# EAGLE design CAN_SPI (EAGLE 7.1.0)
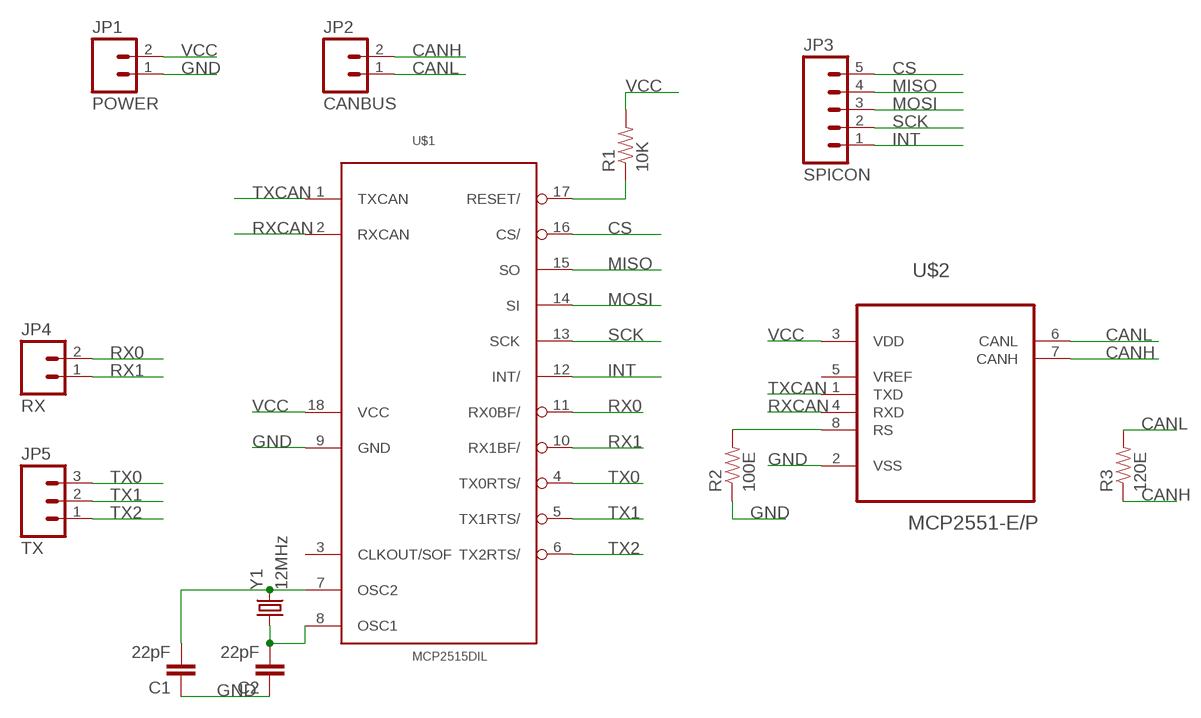
[diagram p0: schematic, sheet 1]

## Parts
C1  22pF  0.1UF-50V-20%(PTH)KIT-EZ  [CAP-PTH-SMALL-KIT]
C2  22pF  0.1UF-50V-20%(PTH)KIT-EZ  [CAP-PTH-SMALL-KIT]
JP1  POWER  M02PTH3  [1X02_LONGPADS]
JP2  CANBUS  M02PTH3  [1X02_LONGPADS]
JP3  SPICON  M05PTH_LONGPADS  [1X05_LONGPADS]
JP4  RX  M02PTH3  [1X02_LONGPADS]
JP5  TX  M03LONGPADS  [1X03_LONGPADS]
R1  10K  1KOHM-1/4W-1%(PTH)  [AXIAL-0.3]
R2  100E  1KOHM-1/4W-1%(PTH)  [AXIAL-0.3]
R3  120E  1KOHM-1/4W-1%(PTH)  [AXIAL-0.3]
U$1  MCP2515DIL  [DIL18]
U$2  MCP2551-E/P  [DIP254P762X432-8]
Y1  12MHz  CRYSTALHC49US  [HC49US]

## Nets
CANH: JP2.2 R3.P$1 U$2.7(CANH)
CANL: JP2.1 R3.P$2 U$2.6(CANL)
CS: JP3.5 U$1.16(CS/)
GND: C1.1 C2.1 JP1.1 R2.P$1 U$1.9(GND) U$2.2(VSS)
INT: JP3.1 U$1.12(INT/)
MISO: JP3.4 U$1.15(SO)
MOSI: JP3.3 U$1.14(SI)
N$3: R1.P$1 U$1.17(RESET/)
N$4: C1.2 U$1.7(OSC2) Y1.2
N$5: C2.2 U$1.8(OSC1) Y1.1
N$6: R2.P$2 U$2.8(RS)
RX0: JP4.2 U$1.11(RX0BF/)
RX1: JP4.1 U$1.10(RX1BF/)
RXCAN: U$1.2(RXCAN) U$2.4(RXD)
SCK: JP3.2 U$1.13(SCK)
TX0: JP5.3 U$1.4(TX0RTS/)
TX1: JP5.2 U$1.5(TX1RTS/)
TX2: JP5.1 U$1.6(TX2RTS/)
TXCAN: U$1.1(TXCAN) U$2.1(TXD)
VCC: JP1.2 R1.P$2 U$1.18(VCC) U$2.3(VDD)
Unconnected: U$1.3(CLKOUT/SOF) U$2.5(VREF)

## Library data of the parts
C1 C2 = SparkFun-Capacitors:0.1UF-50V-20%(PTH): CAP-08370; PROD_ID: CAP-08370
JP1 JP2 JP4 = SparkFun-Connectors:M02: Standard 2-pin 0.1" header. Use with - straight break away headers ( PRT-00116) - right angle break away headers (PRT-00553) - swiss pins (PRT-00743) - machine pins (PRT-00117) - female headers (PRT-00115) Molex polarized connector foot print use with: PRT-08233 with associated crimp pins and housings. 2.54_SCREWTERM for use with PRT-10571. 3.5mm Screw Terminal footprints for PRT-08084 5mm Screw Terminal footprints for use with PRT-08432
JP3 = SparkFun-Connectors:M05: Header 5 Standard 5-pin 0.1" header. Use with straight break away headers (SKU : PRT-00116), right angle break away headers (PRT-00553), swiss pins (PRT-00743), machine pins (PRT-00117), and female headers (PRT-00115). Molex polarized connector foot print use with SKU : PRT-08230 with associated crimp pins and housings.
JP5 = SparkFun-Connectors:M03: Header 3 Standard 3-pin 0.1" header. Use with straight break away headers (SKU : PRT-00116), right angle break away headers (PRT-00553), swiss pins (PRT-00743), machine pins (PRT-00117), and female headers (PRT-00115). Molex polarized connector foot print use with SKU : PRT-08232 with associated crimp pins and housings.
R1-R3 = SparkFun-Resistors:1KOHM-1/4W-1%(PTH): RES-12182; PROD_ID: RES-12182; VALUE: 1K
U$1 = MCP2515_MT:MCP2515*: MCP2515 Standalone CAN-Controller by Microchip Eagle-Lib. by MartinThomas
U$2 = MCP2551:MCP2551-E/P: High-Speed CAN Transceiver; MPN: MCP2551-E/P; OC_FARNELL: 1439745; OC_NEWARK: 69K7603; PACKAGE: DIP-8; SUPPLIER: Microchip
Y1 = SparkFun-FreqCtrl:CRYSTAL: Various standard crystals. Proven footprints. Spark Fun Electronics SKU : COM-00534

## Board
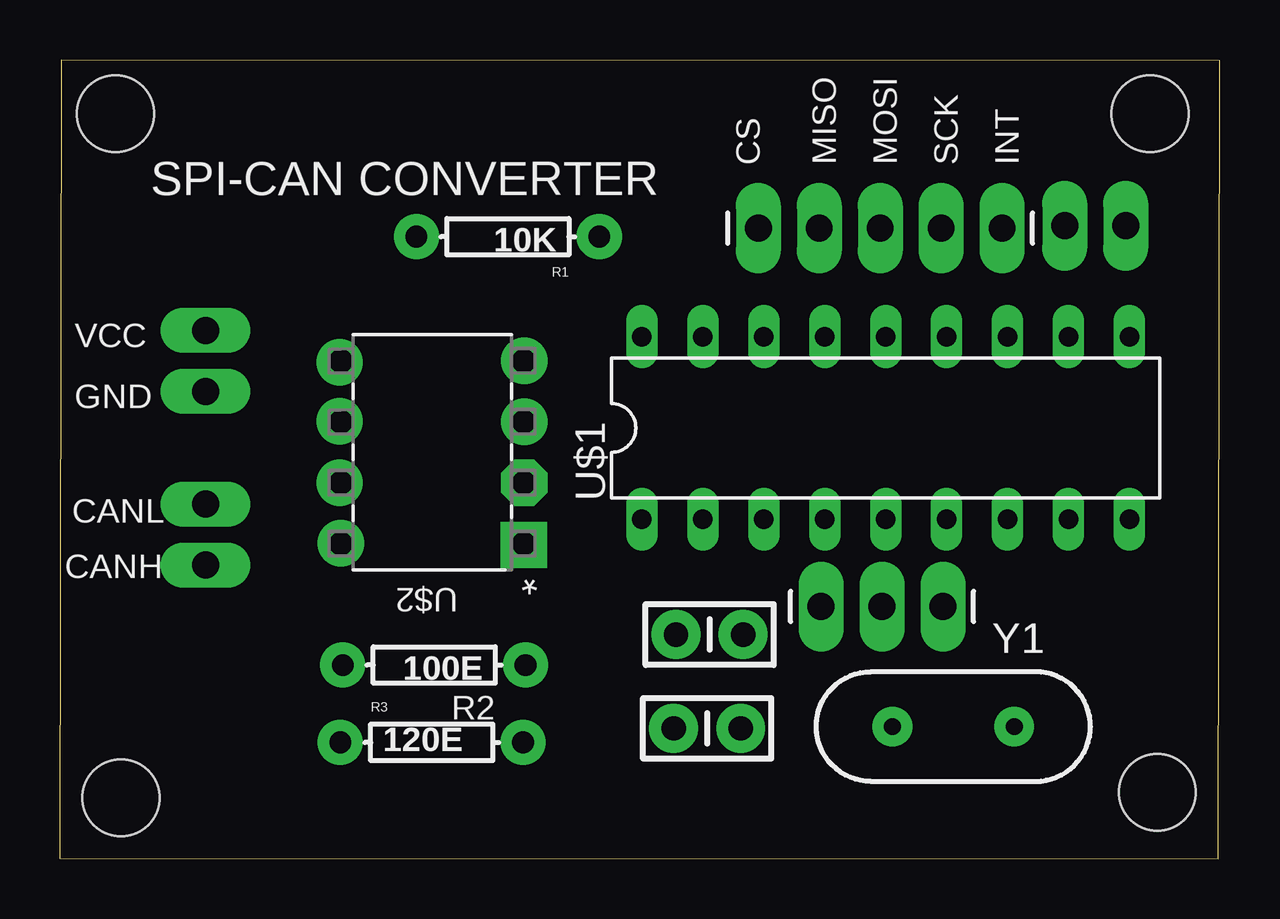
[diagram p1: board, top side]
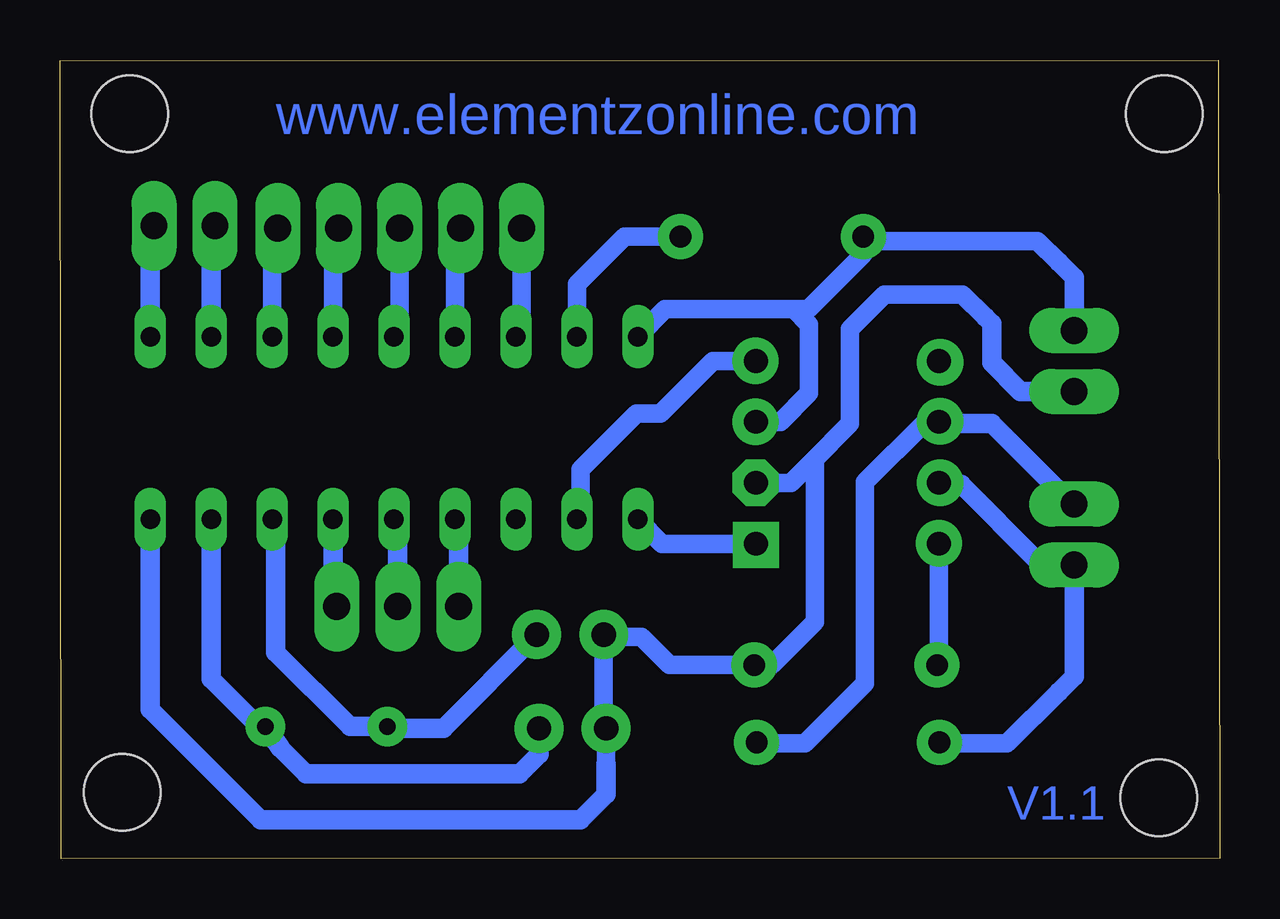
[diagram p2: board, bottom side, seen from below]

Size 48.34 x 33.3 mm. Coordinates in mm from the lower left corner, seen from the top.
Outline: 0,0.03 48.29,0 48.34,33.27 0.05,33.3 0,0.03
Copper layers (1*16): Top 0.035mm / dielectric 1.5mm / Bottom 0.035mm
Design rules "Elementz": minimum track width 16mil, minimum drill 24mil, track to track 16mil, track to pad 24mil, pad to pad 16mil, via to via 16mil, smd to smd 16mil, copper to edge 40mil, drill to drill 8mil, minimum pad ring 10mil, minimum via ring 8mil, stop-mask expansion 4mil, vias tented up to drill 0mil, thermal gap 10mil
Holes 3.2 mm at 2.31,31.06 2.54,2.54 45.75,2.77 45.44,31.06

### Footprints (pad centres in the part's own frame; a part is rotated, then mirrored left to right if it is on the bottom)
CAP-PTH-SMALL-KIT = drill 1.016 pad 2.032: 1 -1.397,0; 2 1.397,0
1X02_LONGPADS = drill 1.118 pad 1.88 long: 1 0,0; 2 2.54,0
1X05_LONGPADS = drill 1.118 pad 1.88 long: 1 0,0; 2 2.54,0; 3 5.08,0; 4 7.62,0; 5 10.16,0
1X03_LONGPADS = drill 1.118 pad 1.88 long: 1 0,0; 2 2.54,0; 3 5.08,0
AXIAL-0.3 = drill 0.9 pad 1.88: P$1 -3.81,0; P$2 3.81,0
DIL18 = drill 0.813 long: 1 -10.16,-3.81; 2 -7.62,-3.81; 3 -5.08,-3.81; 4 -2.54,-3.81; 5 0,-3.81; 6 2.54,-3.81; 7 5.08,-3.81; 8 7.62,-3.81; 9 10.16,-3.81; 10 10.16,3.81; 11 7.62,3.81; 12 5.08,3.81; 13 2.54,3.81; 14 0,3.81; 15 -2.54,3.81; 16 -5.08,3.81; 17 -7.62,3.81; 18 -10.16,3.81
DIP254P762X432-8 = drill 0.991 square: 1 -7.62,7.62 | drill 0.991: 2 -7.62,5.08; 3 -7.62,2.54; 4 -7.62,0; 5 0,0; 6 0,2.54; 7 0,5.08; 8 0,7.62
HC49US = drill 0.7 pad 1.651: 1 -2.54,0; 2 2.54,0

### Placement (x,y rotation side)
C1  27.08,9.35 0 top
C2  26.97,5.44 0 top
JP1  6.07,19.48 90 top
JP2  6.07,14.78 270 top
JP3  39.27,26.29 180 top
JP4  44.42,26.39 180 top
JP5  36.8,10.52 180 top
R1  18.67,25.93 180 top
R2  15.6,8.08 180 top
R3  15.49,4.85 0 top
U$1  34.42,17.96 0 top
U$2  11.71,20.75 180 top
Y1  37.24,5.51 180 top

### Tracks (layer width: path | path; a pad name or v marks a point on that pad's centre or on a via)
CANH
  Bottom 0.762: 6.71,6.96 8.86,4.8 11.63,4.8 R3.P$1
  Bottom 0.813: 6.71,6.96 6.07,7.59 JP2.2 6.25,12.42 7.59,12.42 10.77,15.6 11.63,15.6 U$2.7
CANL
  Bottom 0.762: U$2.6 12.27,18.21 14.78,15.7 14.78,7.32 17.3,4.8 19.25,4.8 R3.P$2
  Bottom 0.813: JP2.1 6.15,14.78 9.5,18.14 11.63,18.14 U$2.6
CS
  Bottom 0.762: JP3.5 29.11,22 U$1.16
GND
  Bottom 0.762: 9.78,22.58 10.72,23.52 13.97,23.52 15.42,22.07 15.42,18.14 17.01,16.55 | 17.01,16.55 17.88,15.67 U$2.2 | 17.01,16.55 16.87,16.41 16.87,9.88 18.67,8.08 R2.P$1 22.94,8.08 24.1,9.25 25.58,9.25 C1.1 25.68,5.54 C2.1 25.58,3.96
  Bottom 0.813: 25.58,3.96 25.58,2.69 26.64,1.63 39.98,1.63 44.58,6.22 U$1.9 | JP1.1 8.31,19.48 9.5,20.68 9.5,22.3 9.78,22.58
INT
  Bottom 0.762: U$1.12 39.5,26.06 JP3.1
MISO
  Bottom 0.762: U$1.15 31.88,26.06 JP3.4
MOSI
  Bottom 0.762: JP3.3 34.19,22 U$1.14
N$1  (via drill 0.8 pad 1.93)
  other vias: 19.33,13.08
N$2  (via drill 0.8 pad 1.68)
  other vias: 11.66,20.75
N$3
  Bottom 0.762: R1.P$1 24.82,25.93 26.8,23.95 U$1.17
N$4
  Bottom 0.813: U$1.7 39.34,14 39.34,8.61 36.25,5.51 Y1.2 33.99,5.44 32.36,5.44 28.47,9.32 C1.2
N$5
  Bottom 0.813: C2.2 28.37,4.34 29.18,3.53 38.07,3.53 39.14,4.6 Y1.1 40.06,5.51 42.04,7.49 U$1.8
N$6
  Bottom 0.762: U$2.8 11.71,8.15 R2.P$2
N$7  (via drill 0.8 pad 1.93)
  other vias: 11.66,18.24
N$8  (via drill 0.8 pad 1.93)
  other vias: 11.66,15.67
N$9  (via drill 0.8 pad 1.93)
  other vias: 11.66,20.7
N$10  (via drill 0.8 pad 1.93)
  other vias: 11.71,13.16
N$11  (via drill 0.8 pad 1.93)
  other vias: 19.35,18.21
N$12  (via drill 0.8 pad 1.93)
  other vias: 19.35,15.67
RX0
  Bottom 0.813: U$1.11 42.04,26.24 JP4.2
RX1
  Bottom 0.813: U$1.10 44.58,26.24 JP4.1
RXCAN  (via drill 0.8 pad 1.93)
  Bottom 0.762: U$2.4 v19.35,20.75 21.13,20.75 23.32,18.57 24.31,18.57 26.64,16.23 26.64,14.3 U$1.2
SCK
  Bottom 0.762: U$1.13 36.96,26.06 JP3.2
TX0
  Bottom 0.813: JP5.3 31.72,14 U$1.4
TX1
  Bottom 0.813: JP5.2 34.26,14 U$1.5
TX2
  Bottom 0.813: U$1.6 36.96,10.67 JP5.1
TXCAN
  Bottom 0.762: U$2.1 23.24,13.13 U$1.1
VCC
  Bottom 0.762: 17.75,22.91 17.14,22.91 14.86,25.2 R1.P$2 14.68,25.76 7.59,25.76 6.71,24.87 | 17.75,22.91 23.11,22.91 U$1.18 | U$2.3 18.31,18.21 17.12,19.41 17.12,22.28 17.75,22.91
  Bottom 0.813: JP1.2 6.07,24.23 6.71,24.87

### Text on the board
Bottom: www.elementzonline.com | V1.1
tNames: CS | MISO | MOSI | SCK | INT | SPI-CAN CONVERTER | VCC | GND | CANL | CANH